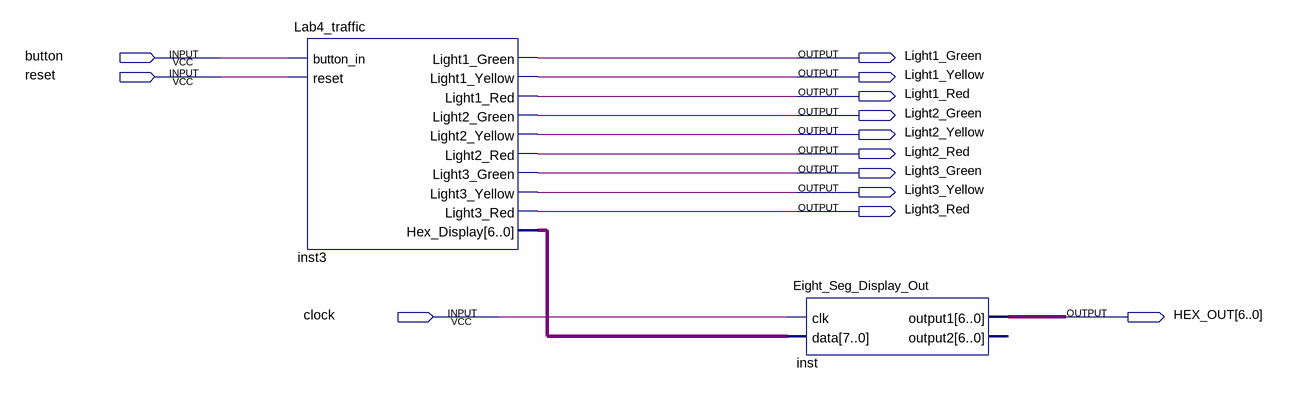
[diagram p0: schematic sheet]
// Quartus schematic Lab4.bdf as structural Verilog: 2 symbols, 13 pins
module Lab4 (
  input  button,
  input  reset,
  input  clock,
  output Light1_Green,
  output Light1_Yellow,
  output Light1_Red,
  output Light2_Green,
  output Light2_Yellow,
  output Light2_Red,
  output Light3_Green,
  output Light3_Yellow,
  output Light3_Red,
  output [6:0] HEX_OUT
);

  wire [7:0] inst3_hex_display;

  Lab4_traffic inst3 (
    .button_in(button), .reset(reset), .Light1_Green(Light1_Green), .Light1_Yellow(Light1_Yellow),
    .Light1_Red(Light1_Red), .Light2_Green(Light2_Green), .Light2_Yellow(Light2_Yellow),
    .Light2_Red(Light2_Red), .Light3_Green(Light3_Green), .Light3_Yellow(Light3_Yellow),
    .Light3_Red(Light3_Red), .Hex_Display(inst3_hex_display));
  Eight_Seg_Display_Out inst (.clk(clock), .data(inst3_hex_display), .output1(HEX_OUT));  // open: output2
endmodule
